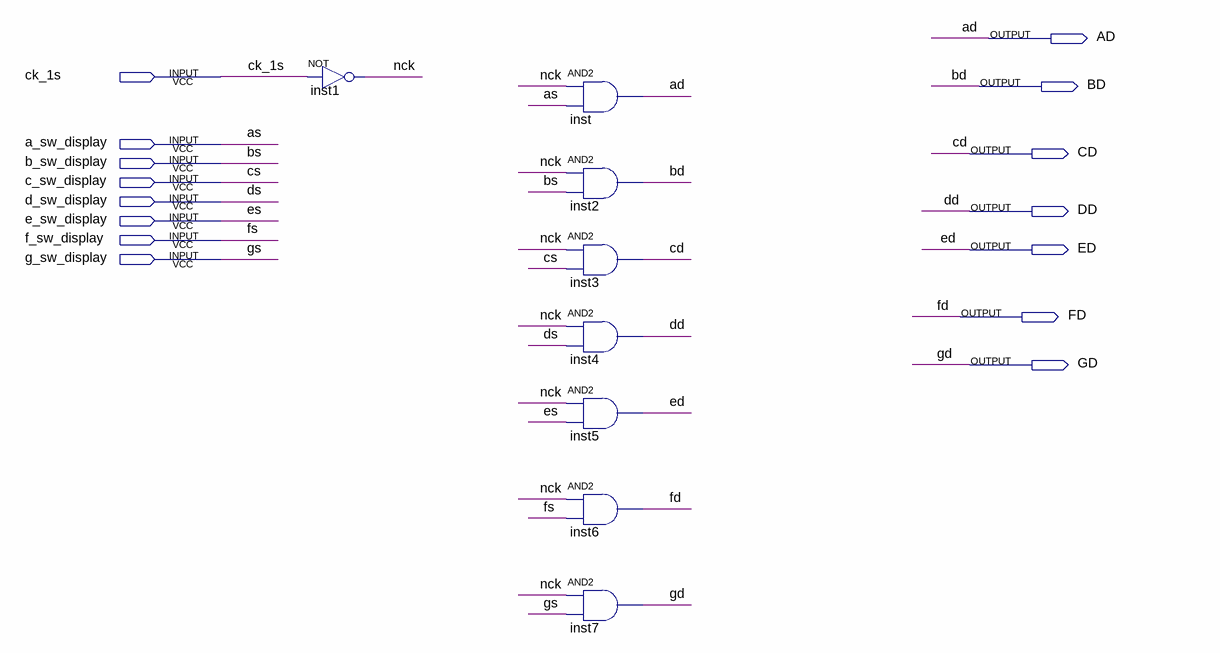
[diagram p0: schematic sheet]
// Quartus schematic pisca.bdf as structural Verilog: 8 symbols, 15 pins
module pisca (
  input  ck_1s,
  input  a_sw_display,
  input  b_sw_display,
  input  c_sw_display,
  input  d_sw_display,
  input  e_sw_display,
  input  f_sw_display,
  input  g_sw_display,
  output AD,
  output BD,
  output CD,
  output DD,
  output ED,
  output FD,
  output GD
);

  wire nck;

  not inst1 (nck, ck_1s);
  and inst (AD, nck, a_sw_display);
  and inst2 (BD, nck, b_sw_display);
  and inst3 (CD, nck, c_sw_display);
  and inst4 (DD, nck, d_sw_display);
  and inst5 (ED, nck, e_sw_display);
  and inst6 (FD, nck, f_sw_display);
  and inst7 (GD, nck, g_sw_display);

  // Other names for the same wires on the sheet: as = a_sw_display; bs = b_sw_display; cs = c_sw_display;
  //   ds = d_sw_display; es = e_sw_display; fs = f_sw_display; gs = g_sw_display
endmodule
